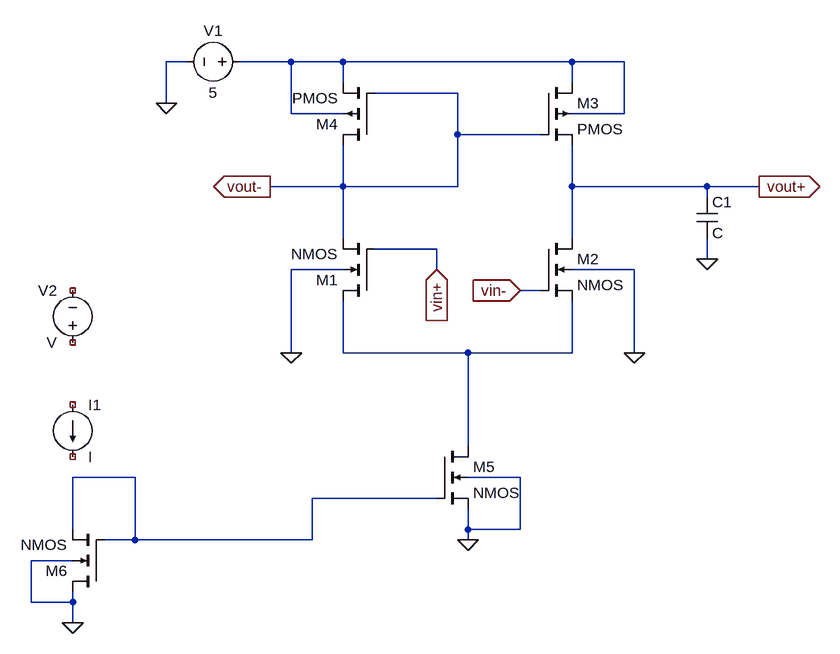
[diagram p0: schematic Draft1.asc]
Draft1.asc, the LTspice schematic file:
Version 4
SHEET 1 880 820
WIRE -240 -64 -272 -64
WIRE -80 -64 -160 -64
WIRE 0 -64 -80 -64
WIRE 352 -64 0 -64
WIRE 432 -64 352 -64
WIRE 0 -32 0 -64
WIRE 352 -32 352 -64
WIRE 176 -16 48 -16
WIRE -272 0 -272 -64
WIRE -80 16 -80 -64
WIRE 0 16 -80 16
WIRE 432 16 432 -64
WIRE 432 16 352 16
WIRE 176 48 176 -16
WIRE 304 48 176 48
WIRE 0 128 0 64
WIRE 0 128 -112 128
WIRE 176 128 176 48
WIRE 176 128 0 128
WIRE 352 128 352 64
WIRE 560 128 352 128
WIRE 640 128 560 128
WIRE 560 144 560 128
WIRE 0 208 0 128
WIRE 352 208 352 128
WIRE 144 224 48 224
WIRE 560 240 560 208
WIRE 0 256 -80 256
WIRE 144 256 144 224
WIRE 448 256 352 256
WIRE 304 288 272 288
WIRE -80 384 -80 256
WIRE 0 384 0 304
WIRE 192 384 0 384
WIRE 352 384 352 304
WIRE 352 384 192 384
WIRE 448 384 448 256
WIRE 192 528 192 384
WIRE -320 576 -416 576
WIRE 272 576 192 576
WIRE 144 608 -48 608
WIRE -416 656 -416 576
WIRE 192 656 192 624
WIRE 272 656 272 576
WIRE 272 656 192 656
WIRE -320 672 -320 576
WIRE -320 672 -368 672
WIRE -48 672 -48 608
WIRE -48 672 -320 672
WIRE 192 672 192 656
WIRE -416 704 -480 704
WIRE -480 768 -480 704
WIRE -416 768 -416 752
WIRE -416 768 -480 768
WIRE -416 800 -416 768
FLAG 192 672 0
FLAG -416 800 0
FLAG 560 240 0
FLAG -80 384 0
FLAG 448 384 0
FLAG 640 128 vout+
IOPIN 640 128 Out
FLAG 272 288 vin-
IOPIN 272 288 In
FLAG 144 256 vin+
IOPIN 144 256 In
FLAG -112 128 vout-
IOPIN -112 128 Out
FLAG -272 0 0
SYMBOL nmos4 48 304 R180
SYMATTR InstName M1
SYMBOL nmos4 304 208 R0
SYMATTR InstName M2
SYMBOL pmos4 304 -32 R0
SYMATTR InstName M3
SYMBOL pmos4 48 64 R180
SYMATTR InstName M4
SYMBOL cap 544 144 R0
SYMATTR InstName C1
SYMBOL voltage -144 -64 R90
WINDOW 0 -32 56 VBottom 2
WINDOW 3 32 56 VTop 2
WINDOW 123 0 0 Left 0
WINDOW 39 0 0 Left 0
SYMATTR InstName V1
SYMATTR Value 5
SYMBOL nmos4 144 528 R0
SYMATTR InstName M5
SYMBOL nmos4 -368 752 R180
SYMATTR InstName M6
SYMBOL current -416 464 R0
SYMATTR InstName I1
SYMBOL voltage -416 384 R180
WINDOW 0 24 96 Left 2
WINDOW 3 24 16 Left 2
SYMATTR InstName V2

The netlist it stands for:
* Draft1.asc
M1 N002 vin+ vout- 0 NMOS
M2 vout+ vin- N002 0 NMOS
M3 N001 vout- vout+ N001 PMOS
M4 vout- vout- N001 N001 PMOS
C1 vout+ 0 C
V1 N001 0 5
M5 N002 N003 0 0 NMOS
M6 0 N003 N003 0 NMOS
I1 NC_01 NC_02 I
V2 NC_03 NC_04 V
.model NMOS NMOS
.model PMOS PMOS
.lib standard.mos
.backanno
.end